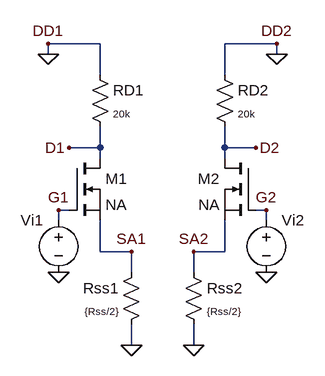
[diagram p0: schematic DifferentialAmplifierSmallSignalEq.asc]
DifferentialAmplifierSmallSignalEq.asc, the LTspice schematic file:
Version 4
SHEET 1 880 680
WIRE 256 -80 176 -80
WIRE 528 -80 448 -80
WIRE 176 -64 176 -80
WIRE 528 -64 528 -80
WIRE 256 -32 256 -80
WIRE 448 -32 448 -80
WIRE 256 80 256 48
WIRE 256 80 208 80
WIRE 448 80 448 48
WIRE 496 80 448 80
WIRE 256 96 256 80
WIRE 448 96 448 80
WIRE 208 176 192 176
WIRE 512 176 496 176
WIRE 192 192 192 176
WIRE 512 192 512 176
WIRE 256 240 256 192
WIRE 304 240 256 240
WIRE 448 240 448 192
WIRE 448 240 400 240
WIRE 304 272 304 240
WIRE 400 272 400 240
WIRE 304 384 304 352
WIRE 400 384 400 352
FLAG 528 -80 DD2
FLAG 208 80 D1
FLAG 496 80 D2
FLAG 192 272 0
FLAG 512 272 0
FLAG 192 176 G1
FLAG 512 176 G2
FLAG 528 -64 0
FLAG 176 -64 0
FLAG 176 -80 DD1
FLAG 304 384 0
FLAG 400 384 0
FLAG 304 240 SA1
FLAG 400 240 SA2
SYMBOL nmos 208 96 R0
SYMATTR InstName M1
SYMATTR Value NA
SYMBOL res 240 -48 R0
WINDOW 3 36 76 Left 1
SYMATTR Value 20k
SYMATTR InstName RD1
SYMBOL res 432 -48 R0
WINDOW 3 36 76 Left 1
SYMATTR Value 20k
SYMATTR InstName RD2
SYMBOL voltage 512 176 R0
WINDOW 3 24 96 Invisible 2
SYMATTR InstName Vi2
SYMBOL nmos 496 96 M0
SYMATTR InstName M2
SYMATTR Value NA
SYMBOL voltage 192 176 M0
WINDOW 3 24 96 Invisible 2
SYMATTR InstName Vi1
SYMBOL res 320 256 M0
WINDOW 3 36 76 Left 1
SYMATTR InstName Rss1
SYMATTR Value {Rss/2}
SYMBOL res 384 256 R0
WINDOW 3 36 76 Left 1
SYMATTR InstName Rss2
SYMATTR Value {Rss/2}

The netlist it stands for:
* DifferentialAmplifierSmallSignalEq.asc
M1 D1 G1 SA1 SA1 NA
RD1 0 D1 20k
RD2 0 D2 20k
Vi2 G2 0 V
M2 D2 G2 SA2 SA2 NA
Vi1 G1 0 V
Rss1 SA1 0 {Rss/2}
Rss2 SA2 0 {Rss/2}
.model NMOS NMOS
.model PMOS PMOS
.lib standard.mos
.backanno
.end